# Altium schematic sheet Connectors.SchDoc: Renesas Public Template
size Tabloid; Author: M. Merrill; Company Name: Renesas Electronics America; Organization: Renesas Electronics; Address1: 915 Murphy Ranch Road; Address2: Milpitas, CA  95035; DocumentNumber: 2; Revision: 01; SheetNumber: 2; SheetTotal: 2; CompanyURL: www.renesas.com; PageSetup: Record=PageOptions|CenterHorizontal=True|CenterVertical=True|PrintScale=1.00|XCorrection=1.00|YCorrection=1.00|PrintKind=1|BorderSize=5000000|LeftOffset=0|BottomOffset=0|Orientation=2|PaperLength=1000|PaperWidth=1000|Scale=100|PaperSource=7|PrintQuality=-4|MediaType=1|DitherType=10|PaperKind=A5 148x210mm|PrintScaleMode=1
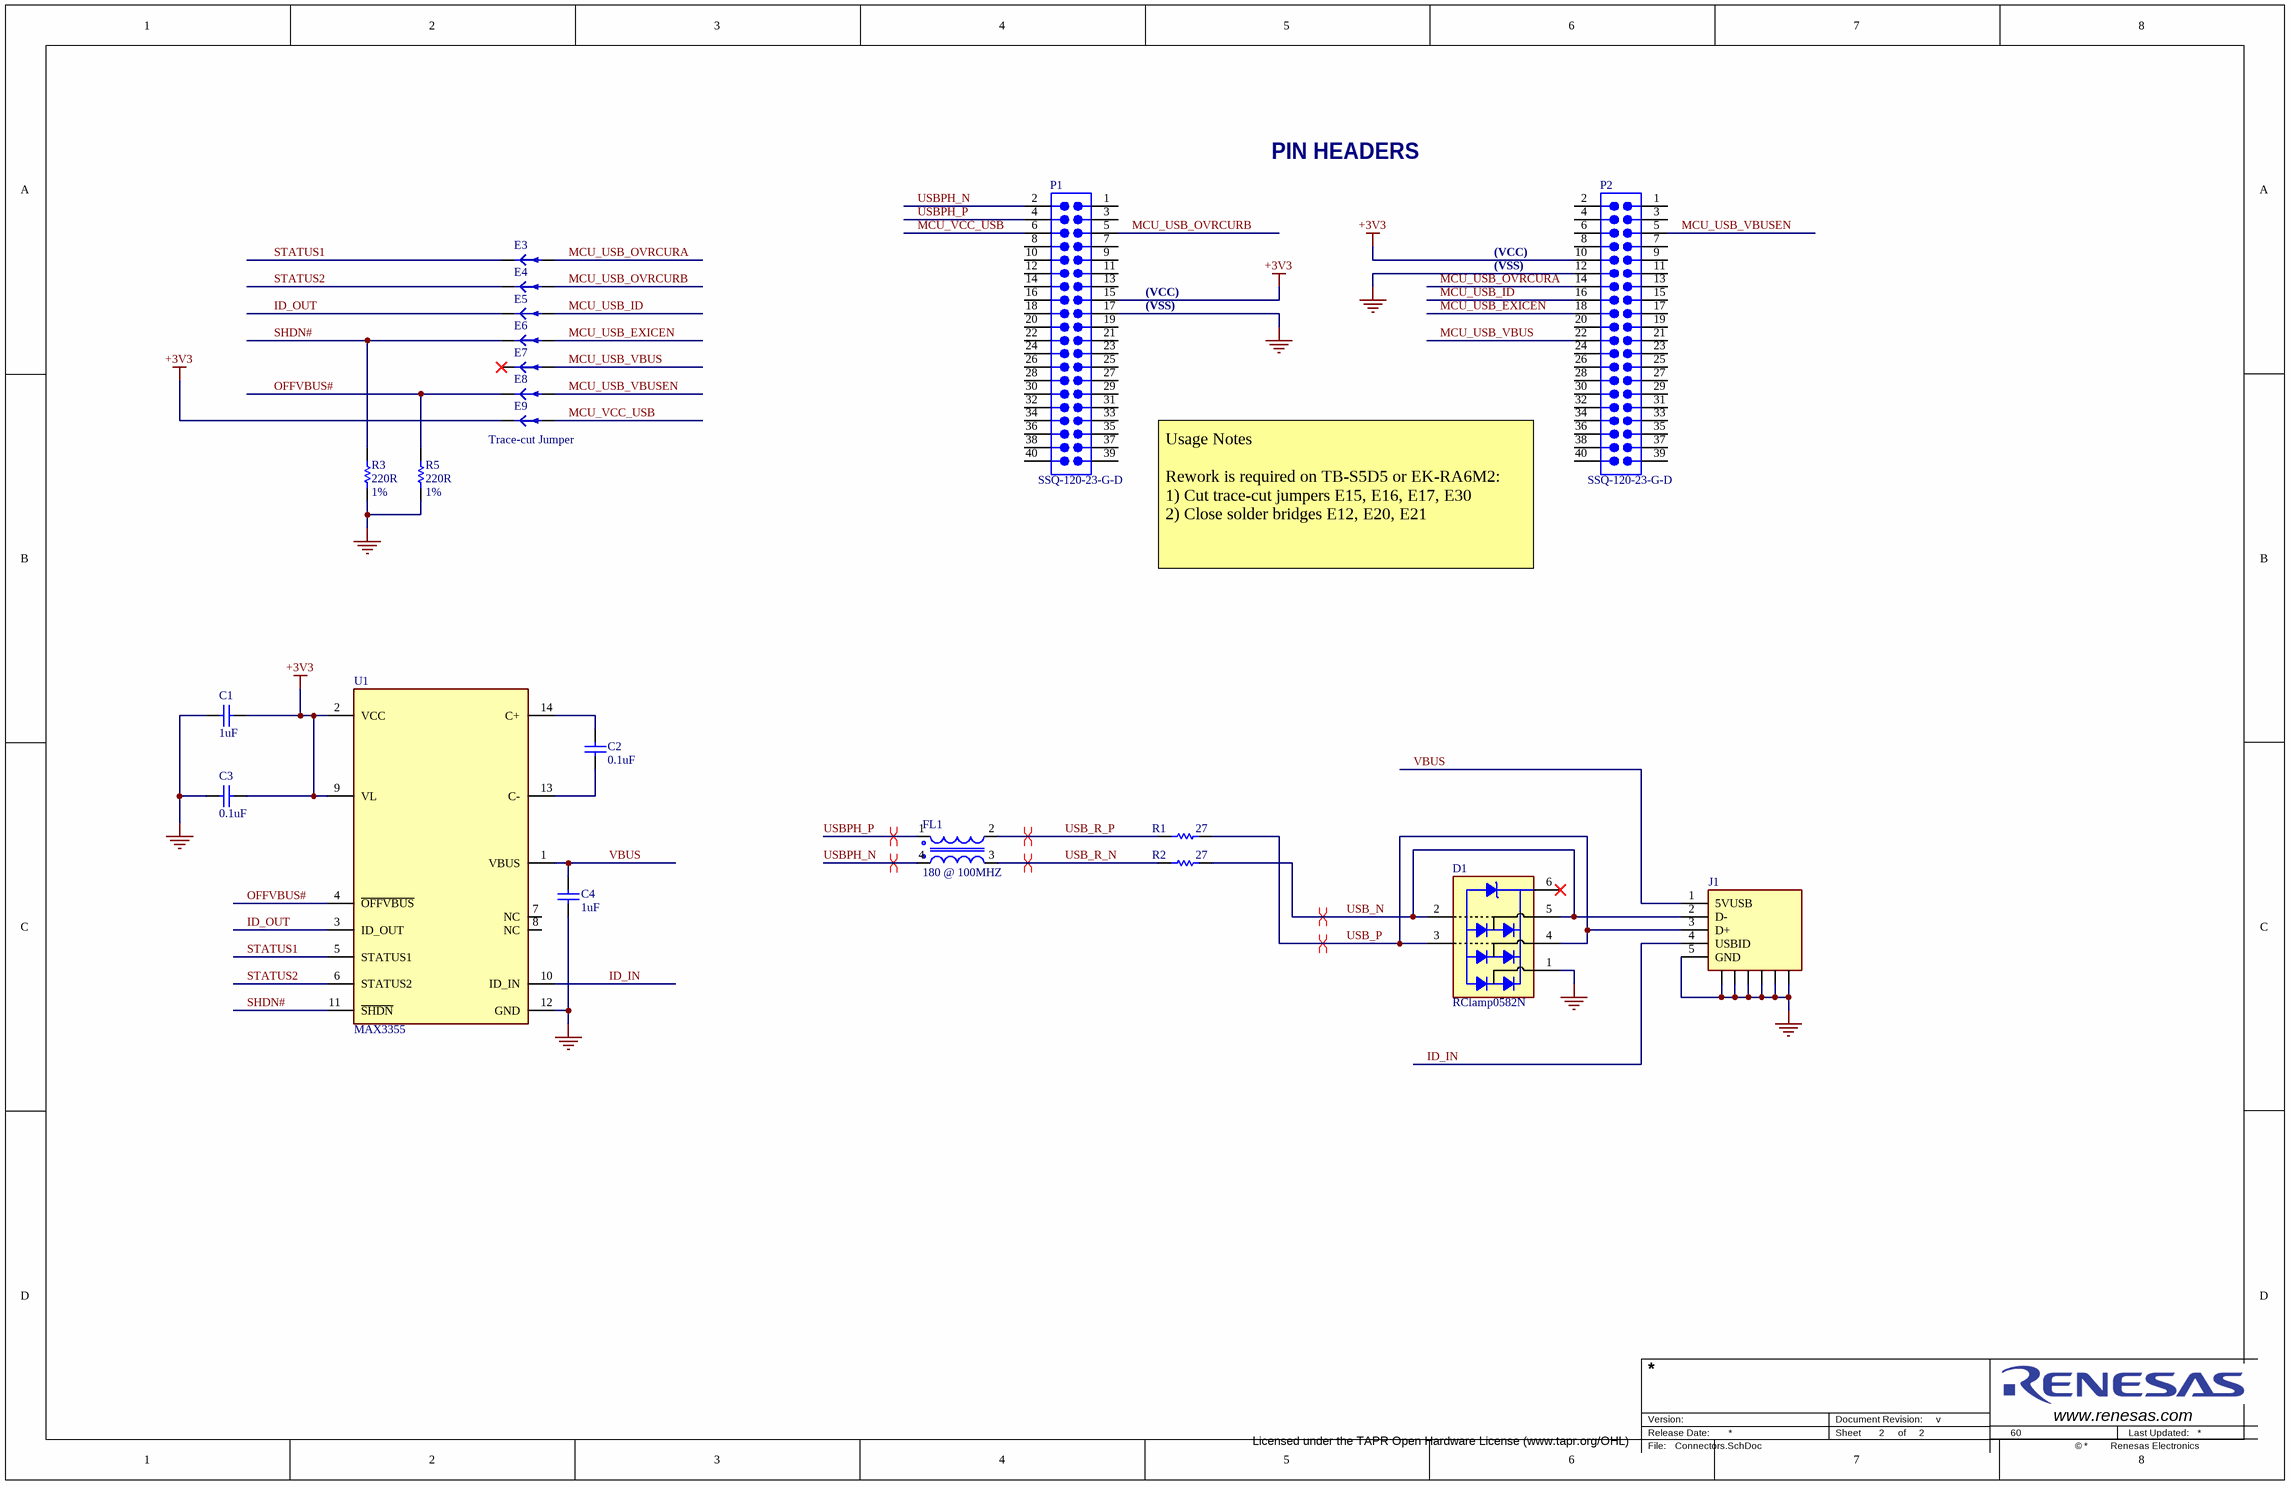
[diagram p0: Connectors.SchDoc]

## Parts
C1  Capacitance: 1uF  [CAPC0603-01]  (hidden comment: CAP-000074-01)
C2  Capacitance: 0.1uF  [CAPC0603-01]  (hidden comment: CAP-000029-01)
C3  Capacitance: 0.1uF  [CAPC0603-01]  (hidden comment: CAP-000029-01)
C4  Capacitance: 1uF  [CAPC0603-01]  (hidden comment: CAP-000074-01)
D1  Display Name: RClamp0582N  [SEMTECH_SLP1210N6]  (hidden comment: DIO-100005-01)
E3  TIE-100001-01  [TraceCut0805]  (value not drawn)  (net tie, no BOM)
E4  TIE-100001-01  [TraceCut0805]  (value not drawn)  (net tie, no BOM)
E5  TIE-100001-01  [TraceCut0805]  (value not drawn)  (net tie, no BOM)
E6  TIE-100001-01  [TraceCut0805]  (value not drawn)  (net tie, no BOM)
E7  TIE-100001-01  [TraceCut0805]  (value not drawn)  (net tie, no BOM)
E8  TIE-100001-01  [TraceCut0805]  (value not drawn)  (net tie, no BOM)
E9  DISPLAY_NAME: Trace-cut Jumper  [TraceCut0805]  (hidden comment: TIE-100001-01)  (net tie, no BOM)
FL1  Resistance: 180 @ 100MHZ  [MURATA_FL0805]  (hidden comment: IND-100014-01)
J1  CON-100013-01  [MOLEX_47589-0001]  (value not drawn)
P1  PN: SSQ-120-23-G-D  [SAMTEC_SSQ-120-23-x-D]  (hidden comment: CON-100032-01)
P2  PN: SSQ-120-23-G-D  [SAMTEC_SSQ-120-23-x-D]  (hidden comment: CON-100032-01)
R1  Resistance: 27  [RESC0603-01]  (hidden comment: RES-100084-01)
R2  Resistance: 27  [RESC0603-01]  (hidden comment: RES-100084-01)
R3  Resistance: 220R  Tolerance: 1%  [RESC0603-01]  (hidden comment: RES-100092-01)
R5  Resistance: 220R  Tolerance: 1%  [RESC0603-01]  (hidden comment: RES-100092-01)
U1  Display Name: MAX3355  [MAXIM_TSSOP-14]  (hidden comment: ICN-110015-01)

## Nets
+3V3: C1.1 C3.1 E9.1(A) P1.15 P2.10 U1.2(VCC) U1.9(VL)
GND: C1.2 C3.2 C4.1 D1.1 J1.5(GND) J1.C1 J1.C2 J1.C3 J1.C4 J1.C5 J1.C6 P1.17 P2.12 R3.1 R5.1 U1.12(GND)
ID_IN: J1.4(USBID) U1.10(ID_IN)
ID_OUT: E5.1(A) U1.3(ID_OUT)
MCU_USB_EXICEN: E6.2(A) P2.18
MCU_USB_ID: E5.2(A) P2.16
MCU_USB_OVRCURA: E3.2(A) P2.14
MCU_USB_OVRCURB: E4.2(A) P1.5
MCU_USB_VBUS: E7.2(A) P2.22
MCU_USB_VBUSEN: E8.2(A) P2.5
MCU_VCC_USB: E9.2(A) P1.6
OFFVBUS#: E8.1(A) R5.2 U1.4(~{OFFVBUS})
SHDN#: E6.1(A) R3.2 U1.11(~{SHDN})
STATUS1: E3.1(A) U1.5(STATUS1)
STATUS2: E4.1(A) U1.6(STATUS2)
USB_N: D1.2(NC) D1.5 J1.2(D-) R2.2
USB_P: D1.3(NC) D1.4 J1.3(D+) R1.2
USB_R_N: FL1.3 R2.1
USB_R_P: FL1.2 R1.1
USBPH_N: FL1.4 P1.2
USBPH_P: FL1.1 P1.4
VBUS: C4.2 J1.1(5VUSB) U1.1(VBUS)
NetC2_1: C2.1 U1.13(C-)
NetC2_2: C2.2 U1.14(C+)

Not connected (* = marked no-connect by the designer): D1 6*; E7 1(A)*; P1 1 3 7 8 9 10 11 12 13 14 16 18 19 20 21 22 23 24 25 26 27 28 29 30 31 32 33 34 35 36 37 38 39 40; P2 1 2 3 4 6 7 8 9 11 13 15 17 19 20 21 23 24 25 26 27 28 29 30 31 32 33 34 35 36 37 38 39 40; U1 7(NC) 8(NC)

## Layout directives
differential pair: USB_N, USB_P, USB_R_N, USB_R_P, USBPH_N, USBPH_P

## Notes on the sheet
- PIN HEADERS
- (VCC)
- (VSS)
- Usage Notes
  Rework is required on TB-S5D5 or EK-RA6M2:
  1) Cut trace-cut jumpers E15, E16, E17, E30
  2) Close solder bridges E12, E20, E21
- Licensed under the TAPR Open Hardware License (www.tapr.org/OHL)
- Version:
- Release Date:
- Document Revision:
- Sheet
- of
- v
- 60
- www.renesas.com <http://www.renesas.com>
- Last Updated:
- File:
- ©
- Renesas Electronics

## Library data of the parts
C1 C4 = CAP-000074-01: Ceramic Chip Capacitor 0603 1uF 50V; Manufacturer: Taiyo Yuden; Mfg Part Number: UMK107BJ105KA-T; Dialectric: X5R; Tolerance: 10%; Old Mfg: Samsung; Old PN: CL10A105KB8NNNC; Voltage: 50V; Package: 0603; Manufacturer 1: Taiyo Yuden; Manufacturer Part Number 1: UMK107BJ105KA-T; Supplier 1: Digi-Key; Supplier Part Number 1: 1276-1860-1-ND; Mfg: Taiyo Yuden; PN: UMK107BJ105KA-T; Supplier 2: Digi-Key; Supplier 3: Mouser; Supplier 4: Farnell; Supplier Part Number 2: 587-2400-1-ND; Supplier Part Number 3: 963-UMK107BJ105KA-T; Supplier Part Number 4: 2112858
C2 C3 = CAP-000029-01: Ceramic Chip Capacitor 0603 0.1uF 50V; Manufacturer: Samsung; Mfg Part Number: CL10B104KB8NNNC; Dialectric: X7R; Tolerance: 10%; Voltage: 50V; Package: 0603; Manufacturer 1: Samsung; Manufacturer Part Number 1: CL10B104KB8NNNC; Mfg: Samsung; PN: CL10B104KB8NNNC; Supplier 1: Digi-Key; Supplier Part Number 1: 1276-1000-1-ND; Supplier 2: RSComponents; Supplier 3: Mouser; Supplier Part Number 2: 7665443; Supplier Part Number 3: 187-CL10B104KB8NNNC
D1 = DIO-100005-01: Semtech TVS Diode Array for USB; Mfg Part Number: RClamp0582N.TCT; Manufacturer: Semtech; Package: SLP1210N6; Manufacturer 1: Semtech; Manufacturer Part Number 1: RClamp0582N.TCT; Supplier 1: Digi-Key; Supplier Part Number 1: RCLAMP0582N.TCTCT-ND; Mfg: Semtech; PN: RClamp0582N.TCT
E3-E9 = TIE-100001-01: Trace-Cut Jumper.  Pads on PCB with Trace Between for Cutting to isolate
  E3-E8: DISPLAY_NAME: Trace-cut Jumper
FL1 = IND-100014-01: Common Mode Filter Inductor, 180 ohm CM @ 100MHz, 0805; Manufacturer: Murata; Mfg Part Number: DLW21SN181SQ2; Current: 330mA; Tolerance: 25%; Package: FL0805; Manufacturer 1: Murata; Manufacturer Part Number 1: DLW21SN181SQ2; Mfg: Murata; PN: DLW21SN181SQ2; Supplier 1: Digi-Key; Supplier Part Number 1: 490-5139-1-ND; Supplier 2: RSComponents; Supplier Part Number 2: 8119745; Supplier 3: Mouser; Supplier Part Number 3: 81-DLW21SN181SQ2L
J1 = CON-100013-01: USB Micro AB 2.0 Female 5 Pin Right Angle Molex; Mfg Part Number: 47589-0001; Value: USB uAB; Manufacturer: Molex; Manufacturer 1: Molex; Manufacturer Part Number 1: 47589-0001; Supplier 1: Digi-Key; Supplier Part Number 1: WM17143CT-ND; Mfg: Molex; PN: 47589-0001
P1 P2 = CON-100032-01: SAMTEC Female Header 0.1" pitch 40pos 2x20, 10mm pins, gold flash tail; Positions: 40; Pitch: 2.54mm; system: connector; Manufacturer: Samtec; Mfg Part Number: SSQ-120-23-G-D; Manufacturer 1: Samtec; Manufacturer Part Number 1: SSQ-120-23-G-D; Supplier 1: Digi-Key; Supplier Part Number 1: SAM11925-ND; Mfg: Samtec; Supplier 2: Mouser; Supplier Part Number 2: 200-SSQ12023GD
R1 R2 = RES-100084-01: Chip Resistor Thick Film 0603 27R0 1% 1/10W; Manufacturer: Yageo; Mfg Part Number: RC0603FR-0727RL; Package: 0603; Power: 1/10W; Tolerance: 1%; Manufacturer 1: Yageo; Manufacturer Part Number 1: RC0603FR-0727RL; Supplier 1: Digi-Key; Supplier Part Number 1: 311-27.0HRCT-ND; Mfg: Yageo; PN: RC0603FR-0727RL; Supplier 2: Mouser; Supplier Part Number 2: 603-RC0603FR-0727RL
R3 R5 = RES-100092-01: Chip Resistor Thick Film 0603 220 ohm 1% 1/10W; Manufacturer: Yageo; Mfg Part Number: RC0603FR-07220RL; Package: 0603; Power: 1/10W; Manufacturer 1: Yageo; Manufacturer Part Number 1: RC0603FR-07220RL; Mfg: Yageo; PN: RC0603FR-07220RL; Supplier 1: Digi-Key; Supplier Part Number 1: 311-220HRCT-ND; Supplier 2: Mouser; Supplier Part Number 2: 603-RC0603FR-07220RL
U1 = ICN-110015-01: USB OTG Charge Pump; Manufacturer: Maxim; Manufacturer Part Number 1: MAX3355EEUD; Manufacturer 1: Maxim; Mfg: Maxim; PN: MAX3355EEUD; Mfg Part Number: MAX3355EEUD; Supplier 1: Digi-Key; Supplier Part Number 1: MAX3355EEUD+-ND; Supplier 2: Mouser; Supplier 3: Farnell; Supplier Part Number 2: 700-MAX3355EEUD; Supplier Part Number 3: 2514394